# Altium schematic sheet TYPEC0 Connector.SchDoc: RK3399 COB Design V1.0
size A3; Author: ABC; Organization: Altium Limited; Address1: L3, 12a Rodborough Rd; Address2: Frenchs Forest; Address3: NSW; Address4: Australia 2086; DocumentNumber: 20; SheetNumber: 20; SheetTotal: 27; PROJECT CODE: A_V1.0
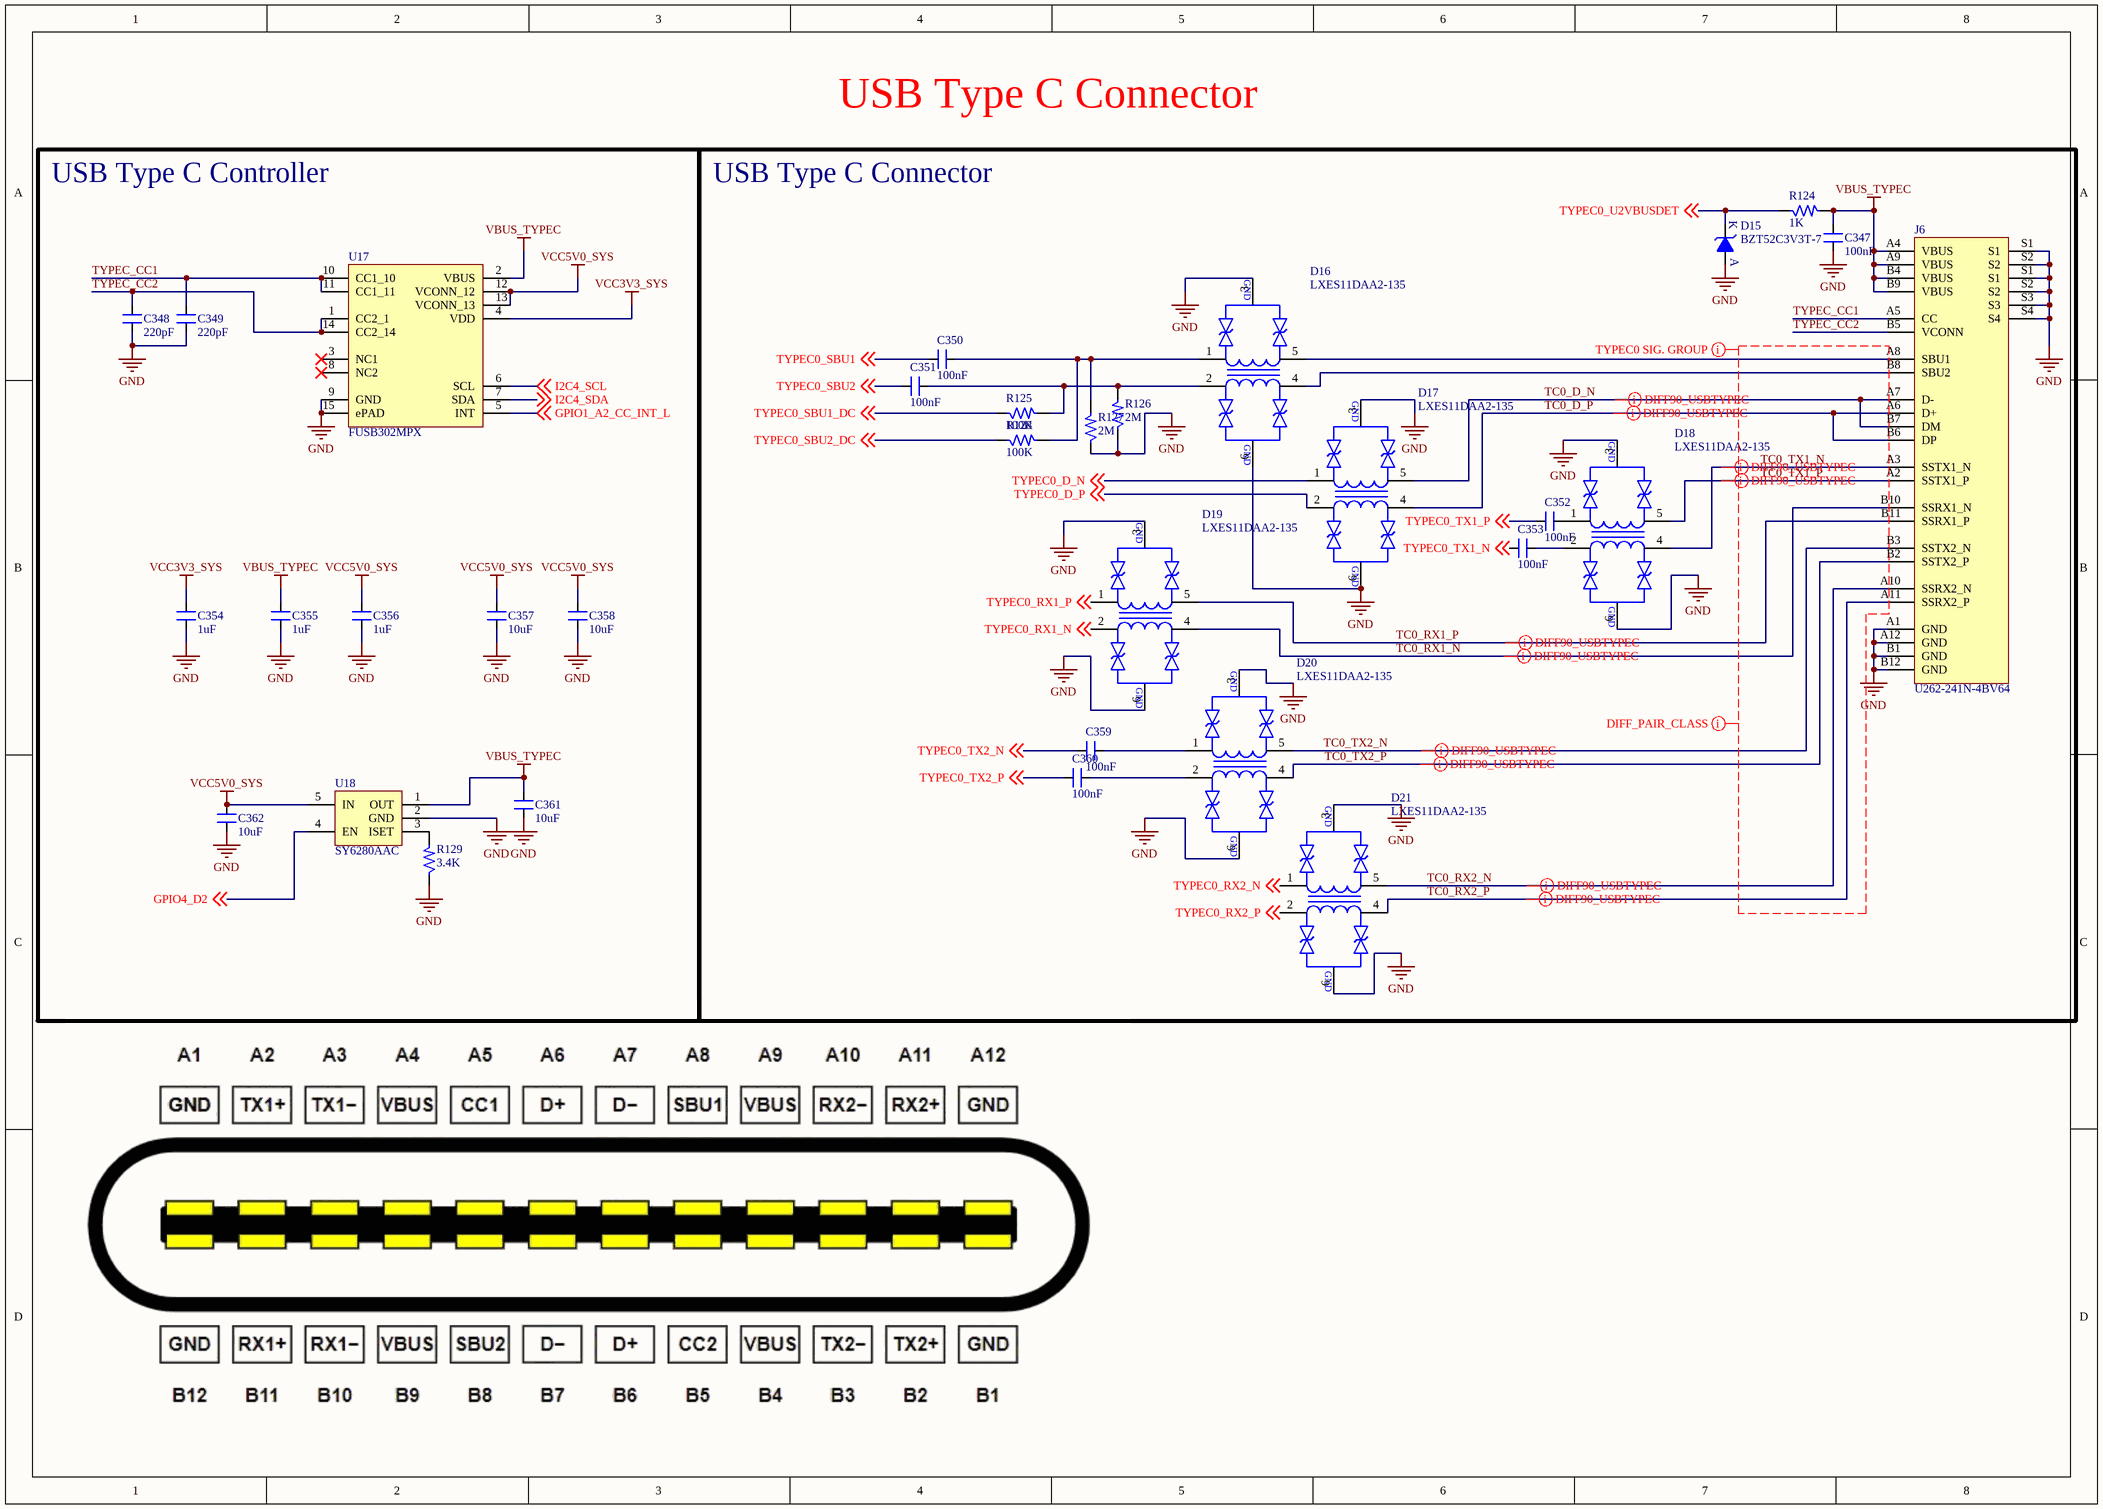
[diagram p0: TYPEC0 Connector.SchDoc]

## Parts
C347  100nF  [CAP_0603]
C348  220pF  [CAP_0603]
C349  220pF  [CAP_0603]
C350  100nF  [CAP_0402]
C351  100nF  [CAP_0402]
C352  100nF  [CAP_0402]
C353  100nF  [CAP_0402]
C354  1uF  [CAP_0603]
C355  1uF  [CAP_0603]
C356  1uF  [CAP_0603]
C357  10uF  [CAP_0805]
C358  10uF  [CAP_0805]
C359  100nF  [CAP_0402]
C360  100nF  [CAP_0402]
C361  10uF  [CAP_0805]
C362  10uF  [CAP_0805]
D15  BZT52C3V3T-7  [DIO_SOD523]
D16  LXES11DAA2-135  [DIO_LXES11D_SMD]
D17  LXES11DAA2-135  [DIO_LXES11D_SMD]
D18  LXES11DAA2-135  [DIO_LXES11D_SMD]
D19  LXES11DAA2-135  [DIO_LXES11D_SMD]
D20  LXES11DAA2-135  [DIO_LXES11D_SMD]
D21  LXES11DAA2-135  [DIO_LXES11D_SMD]
J6  U262-241N-4BV64  [CON24_19.64_U262-241N-4BV64_TH_RA]
R124  1K  [RES_0603]
R125  100K  [RES_0603]
R126  2M  [RES_0603]
R127  2M  [RES_0603]
R128  100K  [RES_0603]
R129  3.4K  [RES_0603]
U17  FUSB302MPX  [MLP-14_98.4X98.4_SMD]
U18  SY6280AAC  [SOT23-5]

## Blocks framed on the sheet
USB Type C Controller: C348 C349 C354-C358 C361 C362 R129 U17 U18
USB Type C Connector: C347 C350-C353 C359 C360 D15-D21 J6 R124-R128

## Nets
GND: C347.1 C348.1 C349.1 C354.1 C355.1 C356.1 C357.1 C358.1 C361.1 C362.1 D15.A D16.3 D16.6 D17.3 D17.6 D18.3 D18.6 D19.3 D19.6 D20.3 D20.6 D21.3 D21.6 J6.A1(GND) J6.A12(GND) J6.B1(GND) J6.B12(GND) J6.S1 J6.S2 J6.S3 J6.S4 R126.1 R127.1 R129.1 U17.9(GND) U17.15(ePAD) U18.2(GND)
VBUS_TYPEC: C347.2 C355.2 C361.2 J6.A4(VBUS) J6.A9(VBUS) J6.B4(VBUS) J6.B9(VBUS) R124.2 U17.2(VBUS) U18.1(OUT)
VCC3V3_SYS: C354.2 U17.4(VDD)
VCC5V0_SYS: C356.2 C357.2 C358.2 C362.2 U17.12(VCONN_12) U17.13(VCONN_13) U18.5(IN)
GPIO1_A2_CC_INT_L: U17.5(INT) ; off-sheet GPIO1_A2_CC_INT_L
GPIO4_D2: U18.4(EN) ; off-sheet GPIO4_D2
I2C4_SCL: U17.6(SCL) ; off-sheet I2C4_SCL
I2C4_SDA: U17.7(SDA) ; off-sheet I2C4_SDA
TC0_D_N: D17.5 J6.A7(D-) J6.B7(DM)
TC0_D_P: D17.4 J6.A6(D+) J6.B6(DP)
TC0_RX1_N: D19.4 J6.B10(SSRX1_N)
TC0_RX1_P: D19.5 J6.B11(SSRX1_P)
TC0_RX2_N: D21.5 J6.A10(SSRX2_N)
TC0_RX2_P: D21.4 J6.A11(SSRX2_P)
TC0_TX1_N: D18.4 J6.A3(SSTX1_N)
TC0_TX1_P: D18.5 J6.A2(SSTX1_P)
TC0_TX2_N: D20.5 J6.B3(SSTX2_N)
TC0_TX2_P: D20.4 J6.B2(SSTX2_P)
TYPEC0_D_N: D17.1 ; off-sheet TYPEC0_D_N
TYPEC0_D_P: D17.2 ; off-sheet TYPEC0_D_P
TYPEC0_RX1_N: D19.2 ; off-sheet TYPEC0_RX1_N
TYPEC0_RX1_P: D19.1 ; off-sheet TYPEC0_RX1_P
TYPEC0_RX2_N: D21.1 ; off-sheet TYPEC0_RX2_N
TYPEC0_RX2_P: D21.2 ; off-sheet TYPEC0_RX2_P
TYPEC0_SBU1: C350.1 ; off-sheet TYPEC0_SBU1
TYPEC0_SBU1_DC: R125.1 ; off-sheet TYPEC0_SBU1_DC
TYPEC0_SBU2: C351.1 ; off-sheet TYPEC0_SBU2
TYPEC0_SBU2_DC: R128.1 ; off-sheet TYPEC0_SBU2_DC
TYPEC0_TX1_N: C353.1 ; off-sheet TYPEC0_TX1_N
TYPEC0_TX1_P: C352.1 ; off-sheet TYPEC0_TX1_P
TYPEC0_TX2_N: C359.1 ; off-sheet TYPEC0_TX2_N
TYPEC0_TX2_P: C360.1 ; off-sheet TYPEC0_TX2_P
TYPEC0_U2VBUSDET: D15.K R124.1 ; off-sheet TYPEC0_U2VBUSDET
TYPEC_CC1: C349.2 J6.A5(CC) U17.10(CC1_10) U17.11(CC1_11)
TYPEC_CC2: C348.2 J6.B5(VCONN) U17.1(CC2_1) U17.14(CC2_14)
NetC350_2: C350.2 D16.1 R127.2 R128.2
NetC351_2: C351.2 D16.2 R125.2 R126.2
NetC352_2: C352.2 D18.1
NetC353_2: C353.2 D18.2
NetC359_2: C359.2 D20.1
NetC360_2: C360.2 D20.2
NetD16_4: D16.4 J6.B8(SBU2)
NetD16_5: D16.5 J6.A8(SBU1)
NetR129_2: R129.2 U18.3(ISET)

Not connected (* = marked no-connect by the designer): U17 3(NC1)* 8(NC2)*

## Layout directives
differential pair; differential pair class DIFF90_USBTYPEC: TC0_D_N, TC0_D_P, TC0_RX1_N, TC0_RX1_P, TC0_RX2_N, TC0_RX2_P, TC0_TX1_N, TC0_TX1_P, TC0_TX2_N, TC0_TX2_P
net class TYPEC0 SIG. GROUP: TC0_TX1_N, TC0_TX1_P
net class DIFF_PAIR_CLASS: TC0_TX1_N, TC0_TX1_P

## Notes on the sheet
- USB Type C Connector
- TITLE:
- DOCUMENT NAME:
- SCALE 1:1
- This document is copyright of Esteempcb and shall not be revealed, produced, copied, in whole or in part, nor
- PROJECT CODE:
- TEMPLATE:
- A3
- AUTHOR:
- Sheet
- of
- used for any purpose other than submitted.
- (in symbol DIO-T-A_5V-6SMD) GND

## Library data of the parts
C347 = CAP_100nF-10V-5%-0603: 0.1µF ±10% 10V Ceramic Capacitor X7R 0603 (1608 Metric) /; Manufacturer: Yageo; Manufacturer Part Number: CC0603KRX7R6BB104; Case/Package: 0603; Supplier-1: Digikey
C348 C349 = CAP_220pF-10V-10%-0603: 220pF ±10% 10V Ceramic Capacitor X7R 0603 (1608 Metric) /; Manufacturer: KEMET; Manufacturer Part Number: C0603C221K8RAC7867; Case/Package: 0603; Supplier-1: Digikey
C350-C353 C359 C360 = CAP_100nF-10V-10%-0402: 0.1µF ±10% 10V Ceramic Capacitor X7R 0402 (1005 Metric) /; Manufacturer: Yageo; Manufacturer Part Number: CC0402KRX7R6BB104; Case/Package: 0402; Supplier-1: Digikey
C354-C356 = CAP_1uF-10V-5%-0603: 1µF ±10% 10V Ceramic Capacitor X5R 0603 (1608 Metric) /; Manufacturer: Samsung Electro-Mechanics; Manufacturer Part Number: CL10A105KP8NNNC; Case/Package: 0603; Supplier-1: Digikey
C357 C358 C361 C362 = CAP_10uF-25V-10%-0805: 10µF ±10% 25V Ceramic Capacitor X5R 0805 (2012 Metric) /; Manufacturer: Murata Electronics; Manufacturer Part Number: GRM21BR61E106KA73K; Case/Package: 0805; Supplier-1: Digikey
D15 = DIO-Z_3.3V-300mW-SOD-523: Zener Diode 3.3V 300mW ±6% Surface Mount SOD-523 /; Manufacturer: Diodes Incorporated; Manufacturer Part Number: BZT52C3V3T-7; Case/Package: SOD523; Supplier-1: Digikey
D16-D21 = DIO-T-A_5V-6SMD: Clamp Ipp Tvs Diode Surface Mount 10-SMD; Manufacturer: Murata Electronics; Manufacturer Part Number: LXES11DAA2-135; Case/Package: SMD-6; Supplier-1: Digikey
J6 = CON-TYPEC_U262-241N-4BV64-SMD: USB - Type C Female 24 SMD USB Connectors RoHS; Manufacturer: XKB Connectivity; Manufacturer Part Number: U262-241N-4BV64; Case/Package: SMD; Supplier-1: LCSC
R124 = RES_1K-0.1W-1%-0603: 1 kOhms ±1% 0.1W, 1/10W Chip Resistor 0603 (1608 Metric) Thick Film /; Manufacturer: Yageo; Manufacturer Part Number: RC0603FR-071KL; Case/Package: 0603; Supplier-1: Digikey
R125 R128 = RES_100K-0.1W-1%-0603: 100 kOhms ±1% 0.1W, 1/10W Chip Resistor 0603 (1608 Metric) Automotive AEC-Q200 Thick Film /; Manufacturer: tackpole Electronics Inc; Manufacturer Part Number: RMCF0603FT100K; Case/Package: 0603; Supplier-1: Digikey
R126 R127 = RES_2M-0.1W-1%-0603: 2 MOhms ±1% 0.1W, 1/10W Chip Resistor 0603 (1608 Metric) Automotive AEC-Q200, Moisture Resistant Thick Film /; Manufacturer: KOA Speer Electronics, Inc.; Manufacturer Part Number: RK73H1JTTD2004F; Case/Package: 0603; Supplier-1: Digikey
R129 = RES_3.4K-0.1W-1%-0603: 3.4 kOhms ±1% 0.1W, 1/10W Chip Resistor 0603 (1608 Metric) Automotive AEC-Q200 Thick Film /; Manufacturer: Stackpole Electronics Inc; Manufacturer Part Number: RMCF0603FT3K40; Case/Package: 0603; Supplier-1: Digikey
U17 = IC_FUSB302MPX: USB Controller USB 3.1 USB Interface 14-MLP (2.5x2.5); Manufacturer: ON Semiconductor; Manufacturer Part Number: FUSB302MPX; Case/Package: 14-MLP; Supplier-1: Digikey
U18 = REG-ADJ_5.5V-5.5V-1.25A-SOT-23-5: SOT-23-5 PMIC - Power Distribution Switches RoHS; Manufacturer: Silergy Corp; Manufacturer Part Number: SY6280AAC; Case/Package: SOT-23-5; Supplier-1: LCSC